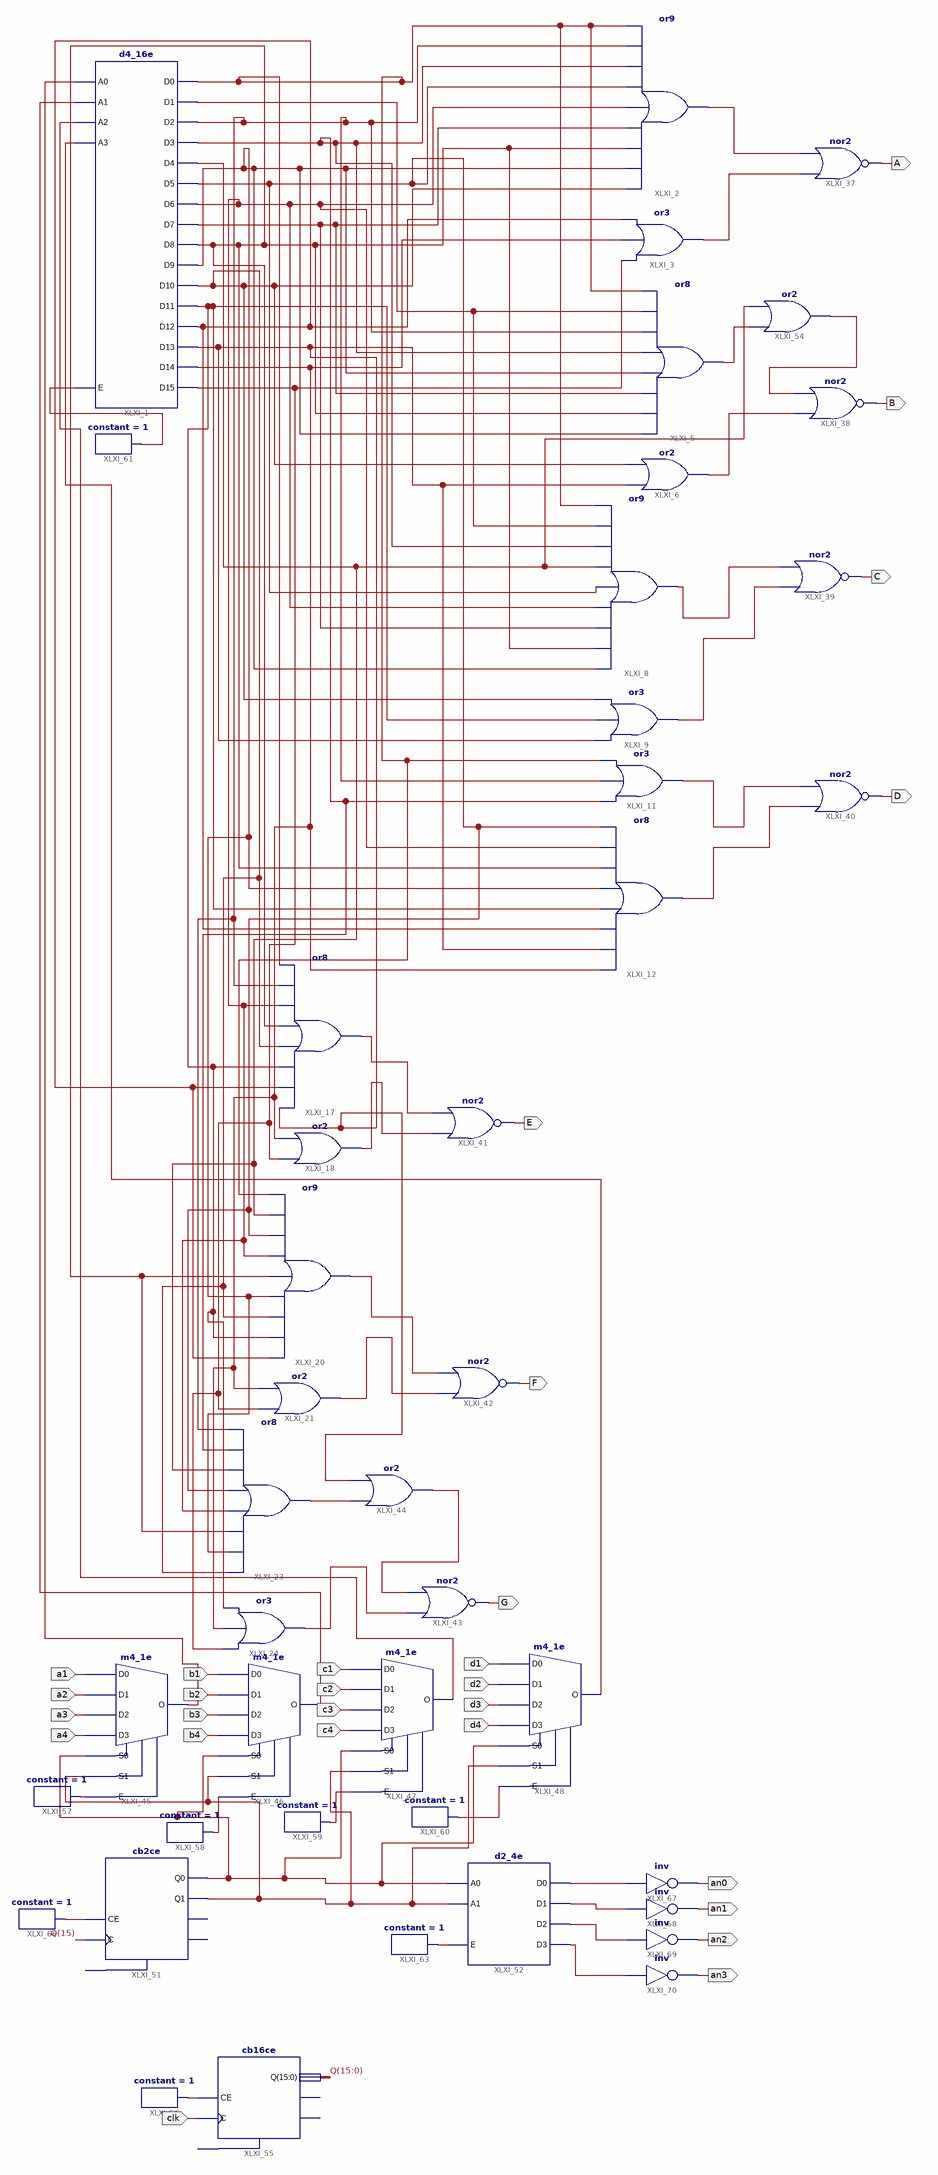
[diagram p0: schematic sheet 1]
// Xilinx ISE schematic lab_5_2.sch (spartan6) as structural Verilog: 43 symbols, 28 ports
module lab_5_2 (
  input  a1,
  input  a2,
  input  a3,
  input  a4,
  input  b1,
  input  b2,
  input  b3,
  input  b4,
  input  c1,
  input  c2,
  input  c3,
  input  c4,
  input  d1,
  input  d2,
  input  d3,
  input  d4,
  input  clk,
  output A,
  output B,
  output C,
  output D,
  output E,
  output F,
  output G,
  output an0,
  output an1,
  output an2,
  output an3
);

  wire XLXN_1, XLXN_2, XLXN_18, XLXN_32, XLXN_34, XLXN_38, XLXN_41, XLXN_46, XLXN_66, XLXN_68, XLXN_73,
       XLXN_75, XLXN_79, XLXN_80, XLXN_82, XLXN_84, XLXN_85, XLXN_86, XLXN_87, XLXN_88, XLXN_89, XLXN_90,
       XLXN_91, XLXN_125, XLXN_129, XLXN_130, XLXN_131, XLXN_132, XLXN_133, XLXN_134, XLXN_151, XLXN_153,
       XLXN_155, XLXN_157, XLXN_160, XLXN_163, XLXN_168, XLXN_169, XLXN_170, XLXN_173, XLXN_180, XLXN_181,
       XLXN_182, XLXN_183, XLXN_184, XLXN_186, XLXN_190, XLXN_191, XLXN_192, XLXN_196;
  wire [15:0] Q;

  d4_16e XLXI_1 (
    .A0(XLXN_151), .A1(XLXN_153), .A2(XLXN_155), .A3(XLXN_157), .E(XLXN_184), .D0(XLXN_75), .D1(XLXN_34),
    .D10(XLXN_41), .D11(XLXN_79), .D12(XLXN_80), .D13(XLXN_68), .D14(XLXN_91), .D15(XLXN_82), .D2(XLXN_84),
    .D3(XLXN_85), .D4(XLXN_86), .D5(XLXN_87), .D6(XLXN_88), .D7(XLXN_38), .D8(XLXN_89), .D9(XLXN_90));
  or XLXI_2 (XLXN_1, XLXN_41, XLXN_90, XLXN_89, XLXN_38, XLXN_88, XLXN_87, XLXN_85, XLXN_84, XLXN_75);
  or XLXI_3 (XLXN_2, XLXN_82, XLXN_91, XLXN_80);
  or XLXI_5 (XLXN_169, XLXN_90, XLXN_89, XLXN_38, XLXN_90, XLXN_85, XLXN_84, XLXN_34, XLXN_75);
  or XLXI_6 (XLXN_18, XLXN_68, XLXN_41);
  or XLXI_8 (XLXN_125, XLXN_90, XLXN_89, XLXN_38, XLXN_88, XLXN_87, XLXN_86, XLXN_85, XLXN_34, XLXN_75);
  or XLXI_9 (XLXN_32, XLXN_68, XLXN_79, XLXN_41);
  or XLXI_11 (XLXN_129, XLXN_85, XLXN_84, XLXN_75);
  or XLXI_12 (XLXN_46, XLXN_91, XLXN_68, XLXN_80, XLXN_79, XLXN_90, XLXN_89, XLXN_88, XLXN_87);
  or XLXI_17 (XLXN_66, XLXN_68, XLXN_80, XLXN_79, XLXN_41, XLXN_89, XLXN_88, XLXN_84, XLXN_75);
  or XLXI_18 (XLXN_130, XLXN_82, XLXN_91);
  or XLXI_20 (XLXN_73, XLXN_80, XLXN_79, XLXN_41, XLXN_90, XLXN_89, XLXN_88, XLXN_87, XLXN_86, XLXN_75);
  or XLXI_21 (XLXN_131, XLXN_82, XLXN_91);
  or XLXI_23 (XLXN_133, XLXN_41, XLXN_90, XLXN_89, XLXN_88, XLXN_87, XLXN_86, XLXN_85, XLXN_84);
  or XLXI_24 (XLXN_132, XLXN_82, XLXN_91, XLXN_79);
  nor XLXI_37 (A, XLXN_2, XLXN_1);
  nor XLXI_38 (B, XLXN_18, XLXN_170);
  nor XLXI_39 (C, XLXN_32, XLXN_125);
  nor XLXI_40 (D, XLXN_46, XLXN_129);
  nor XLXI_41 (E, XLXN_130, XLXN_66);
  nor XLXI_42 (F, XLXN_131, XLXN_73);
  nor XLXI_43 (G, XLXN_132, XLXN_134);
  or XLXI_44 (XLXN_134, XLXN_133, XLXN_68);
  m4_1e XLXI_45 (.D0(a1), .D1(a2), .D2(a3), .D3(a4), .E(XLXN_183), .S0(XLXN_160), .S1(XLXN_163), .O(XLXN_151));
  m4_1e XLXI_46 (.D0(b1), .D1(b2), .D2(b3), .D3(b4), .E(XLXN_182), .S0(XLXN_160), .S1(XLXN_163), .O(XLXN_153));
  m4_1e XLXI_47 (.D0(c1), .D1(c2), .D2(c3), .D3(c4), .E(XLXN_180), .S0(XLXN_160), .S1(XLXN_163), .O(XLXN_155));
  m4_1e XLXI_48 (.D0(d1), .D1(d2), .D2(d3), .D3(d4), .E(XLXN_181), .S0(XLXN_160), .S1(XLXN_163), .O(XLXN_157));
  cb2ce XLXI_51 (.C(Q[15]), .CE(XLXN_168), .Q0(XLXN_160), .Q1(XLXN_163));  // open: CLR, CEO, TC
  d2_4e XLXI_52 (
    .A0(XLXN_160), .A1(XLXN_163), .E(XLXN_186), .D0(XLXN_190), .D1(XLXN_191), .D2(XLXN_192), .D3(XLXN_196));
  or XLXI_54 (XLXN_170, XLXN_169, XLXN_86);
  cb16ce XLXI_55 (.C(clk), .CE(XLXN_173), .Q(Q));  // open: CLR, CEO, TC
  constant #(.CValue("1")) XLXI_56 (.O(XLXN_173));
  constant #(.CValue("1")) XLXI_57 (.O(XLXN_183));
  constant #(.CValue("1")) XLXI_58 (.O(XLXN_182));
  constant #(.CValue("1")) XLXI_59 (.O(XLXN_180));
  constant #(.CValue("1")) XLXI_60 (.O(XLXN_181));
  constant #(.CValue("1")) XLXI_61 (.O(XLXN_184));
  constant #(.CValue("1")) XLXI_66 (.O(XLXN_168));
  constant #(.CValue("1")) XLXI_63 (.O(XLXN_186));
  not XLXI_67 (an0, XLXN_190);
  not XLXI_68 (an1, XLXN_191);
  not XLXI_69 (an2, XLXN_192);
  not XLXI_70 (an3, XLXN_196);
endmodule
